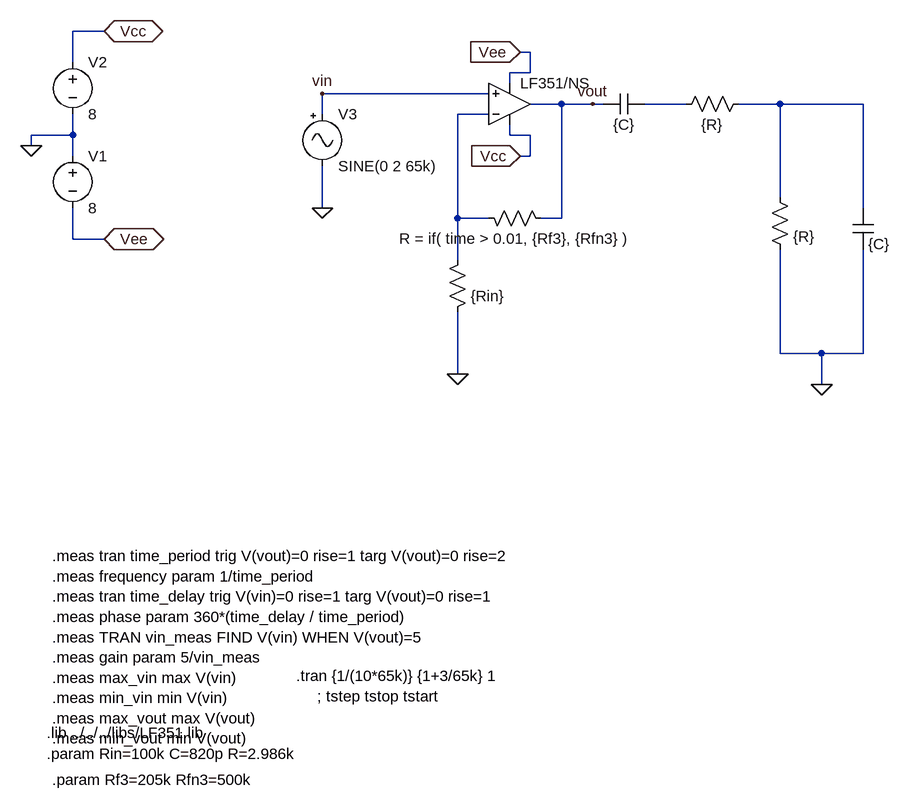
[diagram p0: schematic debugA_proj.asc]
debugA_proj.asc, the LTspice schematic file:
Version 4
SHEET 1 960 1196
WIRE -368 -48 -416 -48
WIRE 288 -16 272 -16
WIRE -416 0 -416 -48
WIRE 288 16 288 -16
WIRE 288 16 256 16
WIRE 256 32 256 16
WIRE 224 48 -32 48
WIRE 336 64 288 64
WIRE 384 64 336 64
WIRE 400 64 384 64
WIRE 528 64 464 64
WIRE 672 64 608 64
WIRE 800 64 672 64
WIRE -32 80 -32 48
WIRE 224 80 176 80
WIRE -416 112 -416 80
WIRE -416 112 -480 112
WIRE 256 112 256 96
WIRE 288 112 256 112
WIRE -480 128 -480 112
WIRE -416 144 -416 112
WIRE 288 144 288 112
WIRE 288 144 272 144
WIRE 672 208 672 64
WIRE -32 224 -32 160
WIRE 800 224 800 64
WIRE 176 240 176 80
WIRE 224 240 176 240
WIRE 336 240 336 64
WIRE 336 240 304 240
WIRE -416 272 -416 224
WIRE -368 272 -416 272
WIRE 176 304 176 240
WIRE 672 448 672 288
WIRE 736 448 672 448
WIRE 800 448 800 288
WIRE 800 448 736 448
WIRE 176 480 176 384
WIRE 736 496 736 448
FLAG 272 144 Vcc
IOPIN 272 144 In
FLAG 272 -16 Vee
IOPIN 272 -16 In
FLAG 176 480 0
FLAG -480 128 0
FLAG -368 -48 Vcc
IOPIN -368 -48 BiDir
FLAG -368 272 Vee
IOPIN -368 272 BiDir
FLAG 736 496 0
FLAG -32 224 0
FLAG -32 48 vin
FLAG 384 64 vout
SYMBOL opamp2 256 128 M180
WINDOW 0 16 32 Invisible 2
SYMATTR InstName U1
SYMATTR Value LF351/NS
SYMBOL res 320 256 M270
WINDOW 0 32 56 Invisible 2
WINDOW 3 0 56 VBottom 2
SYMATTR InstName R1
SYMATTR Value R = if( time > 0.01, {Rf3}, {Rfn3} )
SYMBOL res 160 400 M180
WINDOW 0 36 76 Invisible 2
WINDOW 3 36 40 Left 2
SYMATTR InstName R2
SYMATTR Value {Rin}
SYMBOL res 656 192 R0
WINDOW 0 36 40 Invisible 2
SYMATTR InstName R3
SYMATTR Value {R}
SYMBOL cap 784 224 R0
WINDOW 0 24 8 Invisible 2
SYMATTR InstName C1
SYMATTR Value {C}
SYMBOL res 624 48 R90
WINDOW 0 0 56 Invisible 2
WINDOW 3 32 56 VTop 2
SYMATTR InstName R4
SYMATTR Value {R}
SYMBOL cap 464 48 R90
WINDOW 0 0 32 Invisible 2
WINDOW 3 32 32 VTop 2
SYMATTR InstName C2
SYMATTR Value {C}
SYMBOL voltage -416 128 R0
SYMATTR InstName V1
SYMATTR Value 8
SYMBOL voltage -416 -16 R0
SYMATTR InstName V2
SYMATTR Value 8
SYMBOL Misc/signal -32 64 R0
SYMATTR InstName V3
SYMATTR Value SINE(0 2 65k)
TEXT -456 1032 Left 2 !.lib ../../../libs/LF351.lib
TEXT -456 1064 Left 2 !.param Rin=100k C=820p R=2.986k
TEXT -72 944 Left 2 !.tran {1/(10*65k)} {1+3/65k} 1
TEXT -40 976 Left 2 !; tstep tstop tstart
TEXT -448 1104 Left 2 !.param Rf3=205k Rfn3=500k
TEXT -448 760 Left 2 !.meas tran time_period trig V(vout)=0 rise=1 targ V(vout)=0 rise=2\n.meas frequency param 1/time_period\n.meas tran time_delay trig V(vin)=0 rise=1 targ V(vout)=0 rise=1\n.meas phase param 360*(time_delay / time_period)\n.meas TRAN vin_meas FIND V(vin) WHEN V(vout)=5\n.meas gain param 5/vin_meas\n.meas max_vin max V(vin)\n.meas min_vin min V(vin)\n.meas max_vout max V(vout)\n.meas min_vout min V(vout)

The netlist it stands for:
* debugA_proj.asc
XU1 vin N003 Vcc Vee vout LF351/NS  ; pins In+ In- V+ V- OUT
R1 vout N003 R = if( time > 0.01, {Rf3}, {Rfn3} )
R2 0 N003 {Rin}
R3 N002 0 {R}
C1 N002 0 {C}
R4 N002 N001 {R}
C2 N001 vout {C}
V1 0 Vee 8
V2 Vcc 0 8
V3 vin 0 SINE(0 2 65k)
.lib ../../../libs/LF351.lib
.param Rin=100k C=820p R=2.986k
.tran {1/(10*65k)} {1+3/65k} 1
; tstep tstop tstart
.param Rf3=205k Rfn3=500k
.meas tran time_period trig V(vout)=0 rise=1 targ V(vout)=0 rise=2
.meas frequency param 1/time_period
.meas tran time_delay trig V(vin)=0 rise=1 targ V(vout)=0 rise=1
.meas phase param 360*(time_delay / time_period)
.meas TRAN vin_meas FIND V(vin) WHEN V(vout)=5
.meas gain param 5/vin_meas
.meas max_vin max V(vin)
.meas min_vin min V(vin)
.meas max_vout max V(vout)
.meas min_vout min V(vout)
.backanno
.end